# Altium schematic sheet MCU.SchDoc
size A3; SheetNumber: 8; SheetTotal: 8
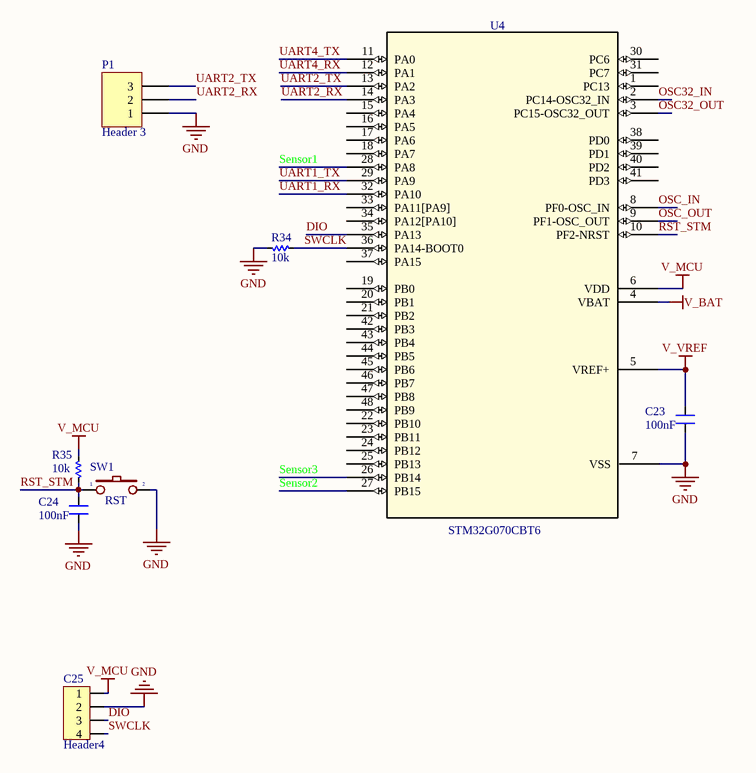
[diagram p0: MCU.SchDoc]

## Parts
C23  100nF  [CN-SMD-0603]
C24  100nF  [CN-SMD-0603]
C25  Header4  [Header4]
P1  Header 3  [Header 3]
R34  10k  [RES-SMD-0603]
R35  10k  [RES-SMD-0603]
SW1  RST  [SW1-SMD]
U4  STM32G070CBT6  [STM32G070CBT6]

## Nets
GND: C23.2 C24.2 C25.2 P1.1 R34.2 SW1.2 U4.7(VSS)
V_BAT: U4.4(VBAT)
V_MCU: C25.1 R35.1 U4.6(VDD)
V_VREF: C23.1 U4.5(VREF+)
DIO: C25.3 U4.35(PA13)
OSC32_IN: U4.2(PC14-OSC32_IN)
OSC32_OUT: U4.3(PC15-OSC32_OUT)
OSC_IN: U4.8(PF0-OSC_IN)
OSC_OUT: U4.9(PF1-OSC_OUT)
RST_STM: C24.1 R35.2 SW1.1 U4.10(PF2-NRST)
Sensor1: U4.28(PA8)
Sensor2: U4.27(PB15)
Sensor3: U4.26(PB14)
SWCLK: C25.4 R34.1 U4.36(PA14-BOOT0)
UART1_RX: U4.32(PA10)
UART1_TX: U4.29(PA9)
UART2_RX: P1.2 U4.14(PA3)
UART2_TX: P1.3 U4.13(PA2)
UART4_RX: U4.12(PA1)
UART4_TX: U4.11(PA0)

Not connected (* = marked no-connect by the designer): U4 1(PC13) 15(PA4) 16(PA5) 17(PA6) 18(PA7) 19(PB0) 20(PB1) 21(PB2) 22(PB10) 23(PB11) 24(PB12) 25(PB13) 30(PC6) 31(PC7) 33(PA11[PA9]) 34(PA12[PA10]) 37(PA15) 38(PD0) 39(PD1) 40(PD2) 41(PD3) 42(PB3) 43(PB4) 44(PB5) 45(PB6) 46(PB7) 47(PB8) 48(PB9)

## Notes on the sheet
- Title
- Size:
- Date:
- A3
- Number:
- Time:
- Revision:
- Sheet
- of
- NICHIETSUVN.COM <http://NICHIETSUVN.COM>
- R&D
- File:

## Library data of the parts
C23 C24 = CN: Value: 33pF
C25 = Header4: Header IDC, 4 x 1 Pin Vertical 2.54mm Pitch (Non-Boxed, Male); Manufacturer: W¨¹rth Elektronik eiSos GmbH; partNo: 613002143121; ComponentLink1 Description: Manufacturer; ComponentLink2 Description: Datasheet; NoPins: 02; Created Date: 29 March 2013; ComponentLink1URL: http://www.we-online.com; ComponentLink2URL: http://katalog.we-online.de/em/datasheet/6130xx143121.pdf; Created by: Karrer Zheng
P1 = Header 3: Header, 3-Pin; LatestRevisionDate: 17-Jul-2002; LatestRevisionNote: Re-released for DXP Platform.; Publisher: Altium Limited
R34 R35 = Res-SMD: Resistor; Manufacturer: Generic Components; Class: Passive; Published: 08/06/2000; Publisher: Altium Hobart Technology Centre
SW1 = SW2: Switch button 2 pin; Value: SW chip 2 pin
U4 = STM32G070CBT6: No Description Available; Vendor: STMicroelectronics; Built_By: EMA_UL_Team; SourceLibrary: Updates_to_database_2020-10-19; Manufacturer_Part_Number: STM32G070CBT6; Copyright: Copyright (C) 2018 Accelerated Designs. All rights reserved; RefDes: RefDes; Type: DEV